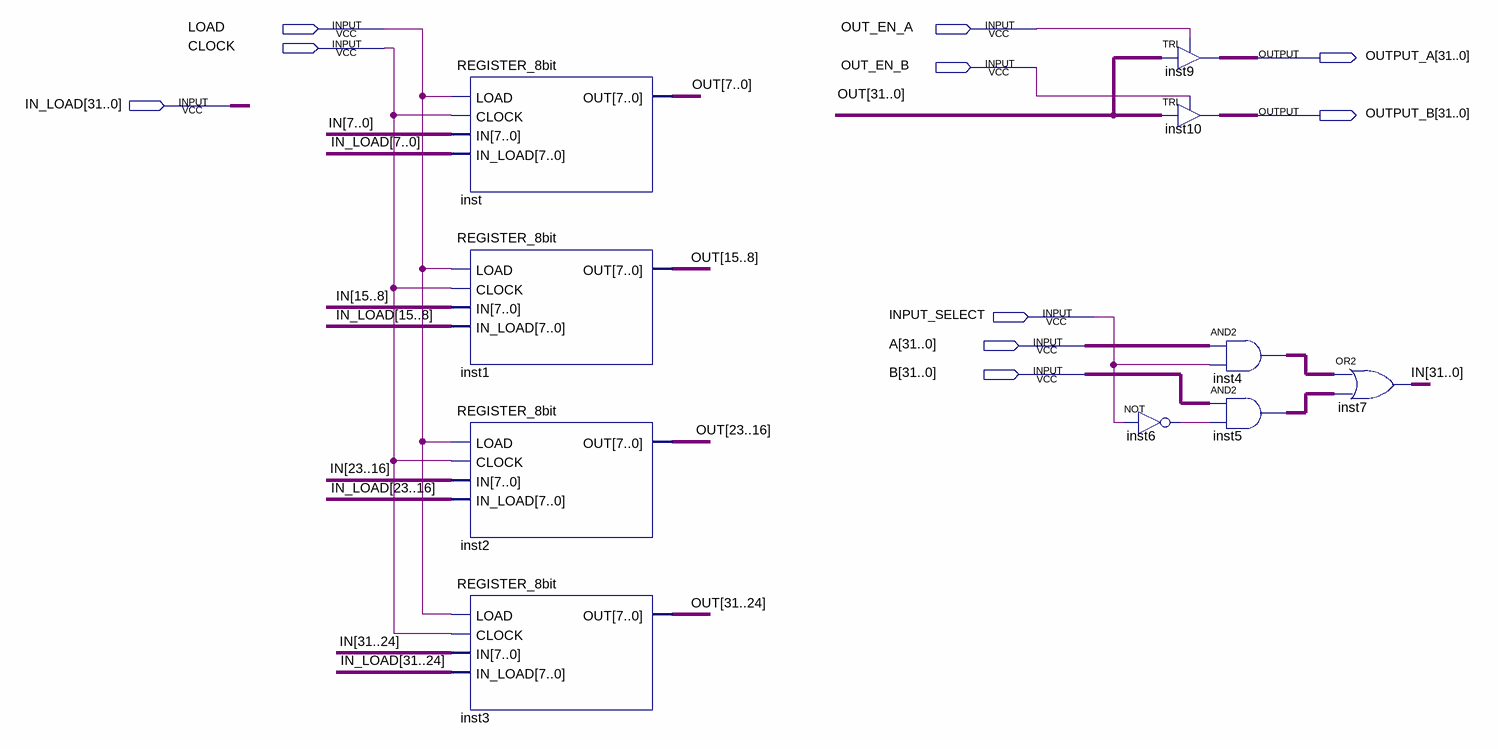
[diagram p0: schematic sheet]
// Quartus schematic REGISTER_32bit.bdf as structural Verilog: 10 symbols, 10 pins
module REGISTER_32bit (
  input  LOAD,
  input  OUT_EN_A,
  input  CLOCK,
  input  OUT_EN_B,
  input  [31:0] IN_LOAD,
  input  INPUT_SELECT,
  input  [31:0] A,
  input  [31:0] B,
  output [31:0] OUTPUT_A,
  output [31:0] OUTPUT_B
);

  wire inst6_out;
  wire [31:0] IN, inst4_out, inst5_out, OUT;

  REGISTER_8bit inst (.LOAD(LOAD), .CLOCK(CLOCK), .IN(IN[7:0]), .IN_LOAD(IN_LOAD[7:0]), .OUT(OUT[7:0]));
  REGISTER_8bit inst1 (.LOAD(LOAD), .CLOCK(CLOCK), .IN(IN[15:8]), .IN_LOAD(IN_LOAD[15:8]), .OUT(OUT[15:8]));
  REGISTER_8bit inst2 (.LOAD(LOAD), .CLOCK(CLOCK), .IN(IN[23:16]), .IN_LOAD(IN_LOAD[23:16]), .OUT(OUT[23:16]));
  REGISTER_8bit inst3 (.LOAD(LOAD), .CLOCK(CLOCK), .IN(IN[31:24]), .IN_LOAD(IN_LOAD[31:24]), .OUT(OUT[31:24]));
  not inst6 (inst6_out, INPUT_SELECT);
  TRI inst9[31:0] (.IN(OUT), .OE(OUT_EN_A), .OUT(OUTPUT_A));
  TRI inst10[31:0] (.IN(OUT), .OE(OUT_EN_B), .OUT(OUTPUT_B));
  assign inst4_out = A & {32{INPUT_SELECT}};  // AND2 inst4, 32 bits wide
  assign inst5_out = B & {32{inst6_out}};  // AND2 inst5, 32 bits wide
  assign IN = inst4_out | inst5_out;  // OR2 inst7, 32 bits wide
endmodule
